# Altium project PCB_F2838_Node.PrjPcb (part 1 of 5)
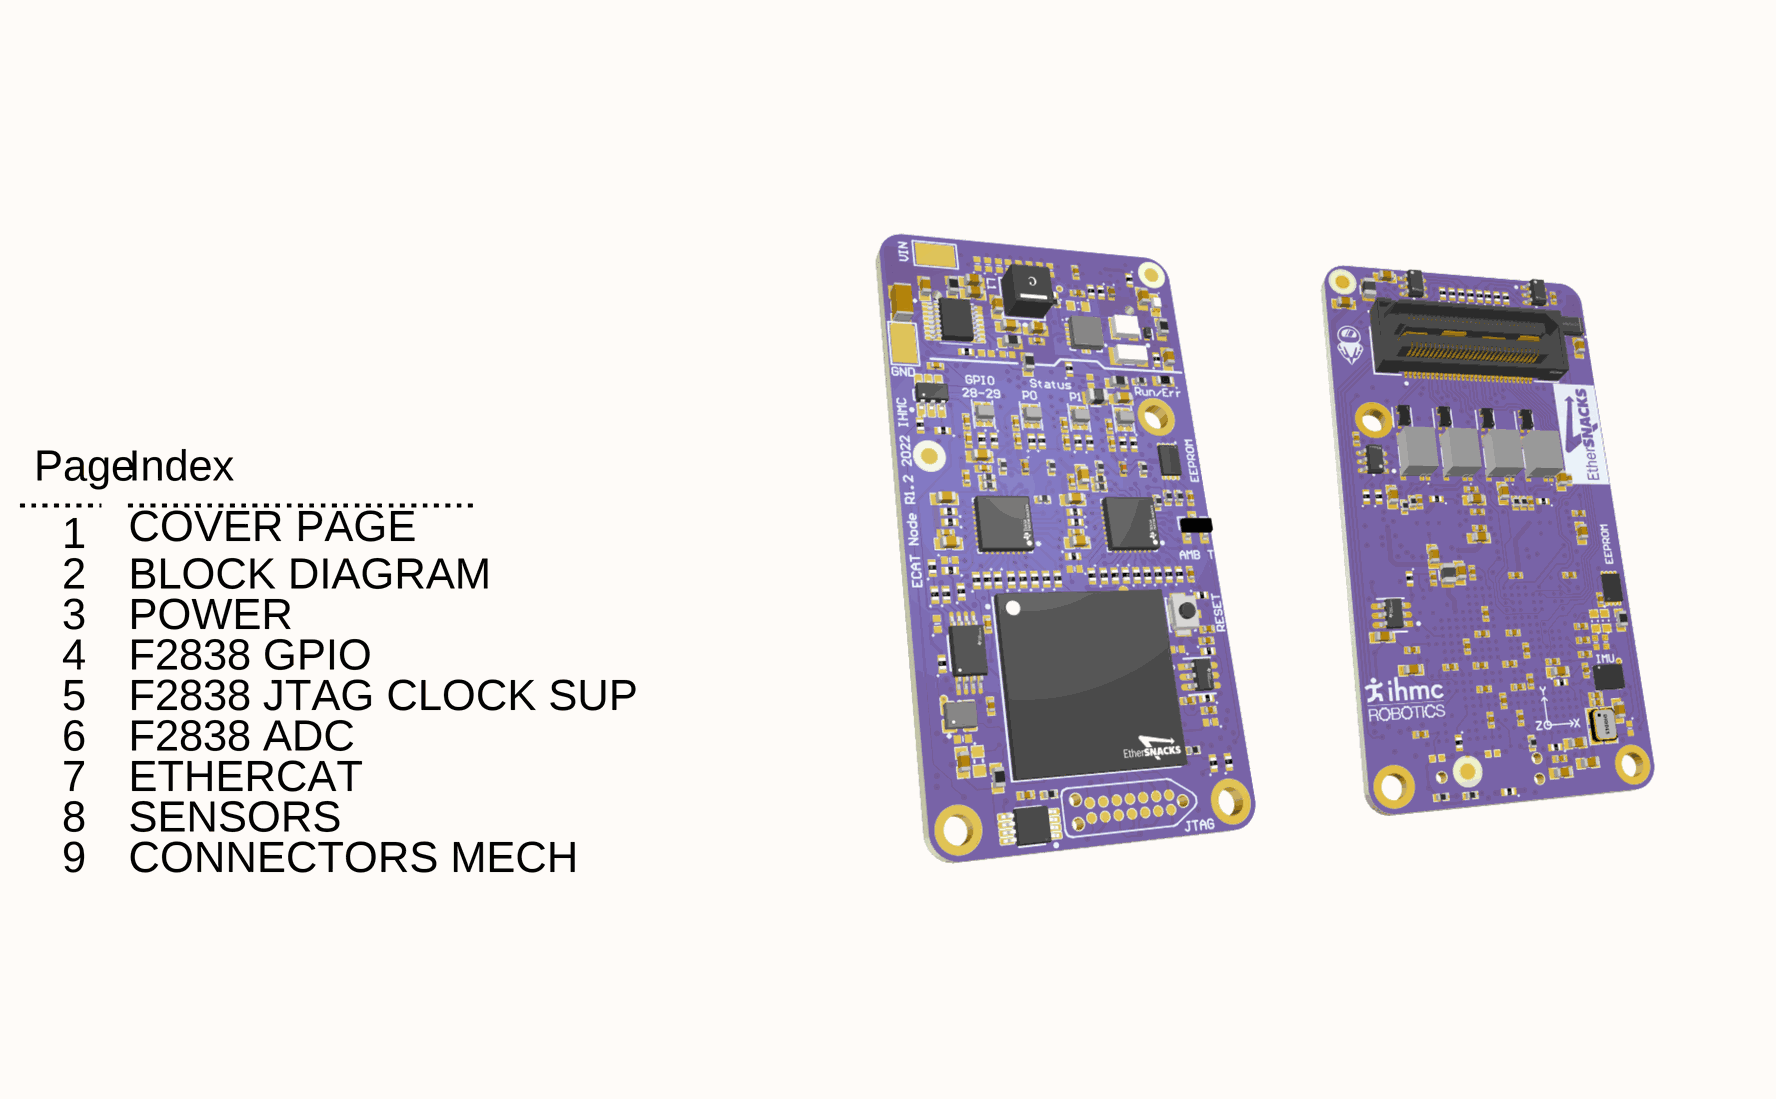
[diagram p0: [0] COVER PAGE.SchDoc]
PCB_Dwg_No: PCB_F2838_Node; Project_Author: A. MASLYCZYK; Project_Date: 24/11/2021; Project_Name: Nadia; Project_Rev_Date: 12/18/2021; Project_Rev_Date_2: 05/09/2022; Project_Revision: 1.1; Project_Revision_2: 1.2; Project_Revision_Description: New stackup 8 layers; Project_Revision_Description_2: Change R77 (ADC REF) to 0R, C54 DNP, onboard EEPROM and revers pol protection added; Project_Title: F28388D_ECAT_Node
9 sheets, 279 parts. Net scope: flat (ports and power ports of the same name join across sheets).
Board file: PCB_F2838_Node.PcbDoc
Sheets:
  [0] COVER PAGE.SchDoc
  [1] BLOCK DIAGRAM.SchDoc
  [2] POWER.SchDoc
  [3] F2838 GPIO.SchDoc
  [4] F2838 JTAG CLOCK SUP.SchDoc
  [5] F2838 ADC.SchDoc
  [6] ETHERCAT.SchDoc
  [7] SENSORS.SchDoc
  [8] CONNECTORS MECH.SchDoc

## Sheet [0] COVER PAGE.SchDoc
size 431 x 279 mm; SheetNumber: 1; SheetTotal: 9

### Notes on the sheet
- Page
- Index
- 1
- COVER PAGE
- 2
- BLOCK DIAGRAM
- 3
- 4
- POWER
- F2838 GPIO
- 5
- 6
- F2838 JTAG CLOCK SUP
- F2838 ADC
- 7
- 8
- ETHERCAT
- SENSORS
- 9
- CONNECTORS MECH
- REVISION
- DESCRIPTION
- DATE
- PROJECT:
- AUTHOR:
- TITLE:
- FILE NAME:
- CUR REV:
- PCB:
- SHEET:
- DATE:
- OF

## Sheet [1] BLOCK DIAGRAM.SchDoc
size 431 x 279 mm; DocumentNumber: 2; SheetNumber: 2; SheetTotal: 9
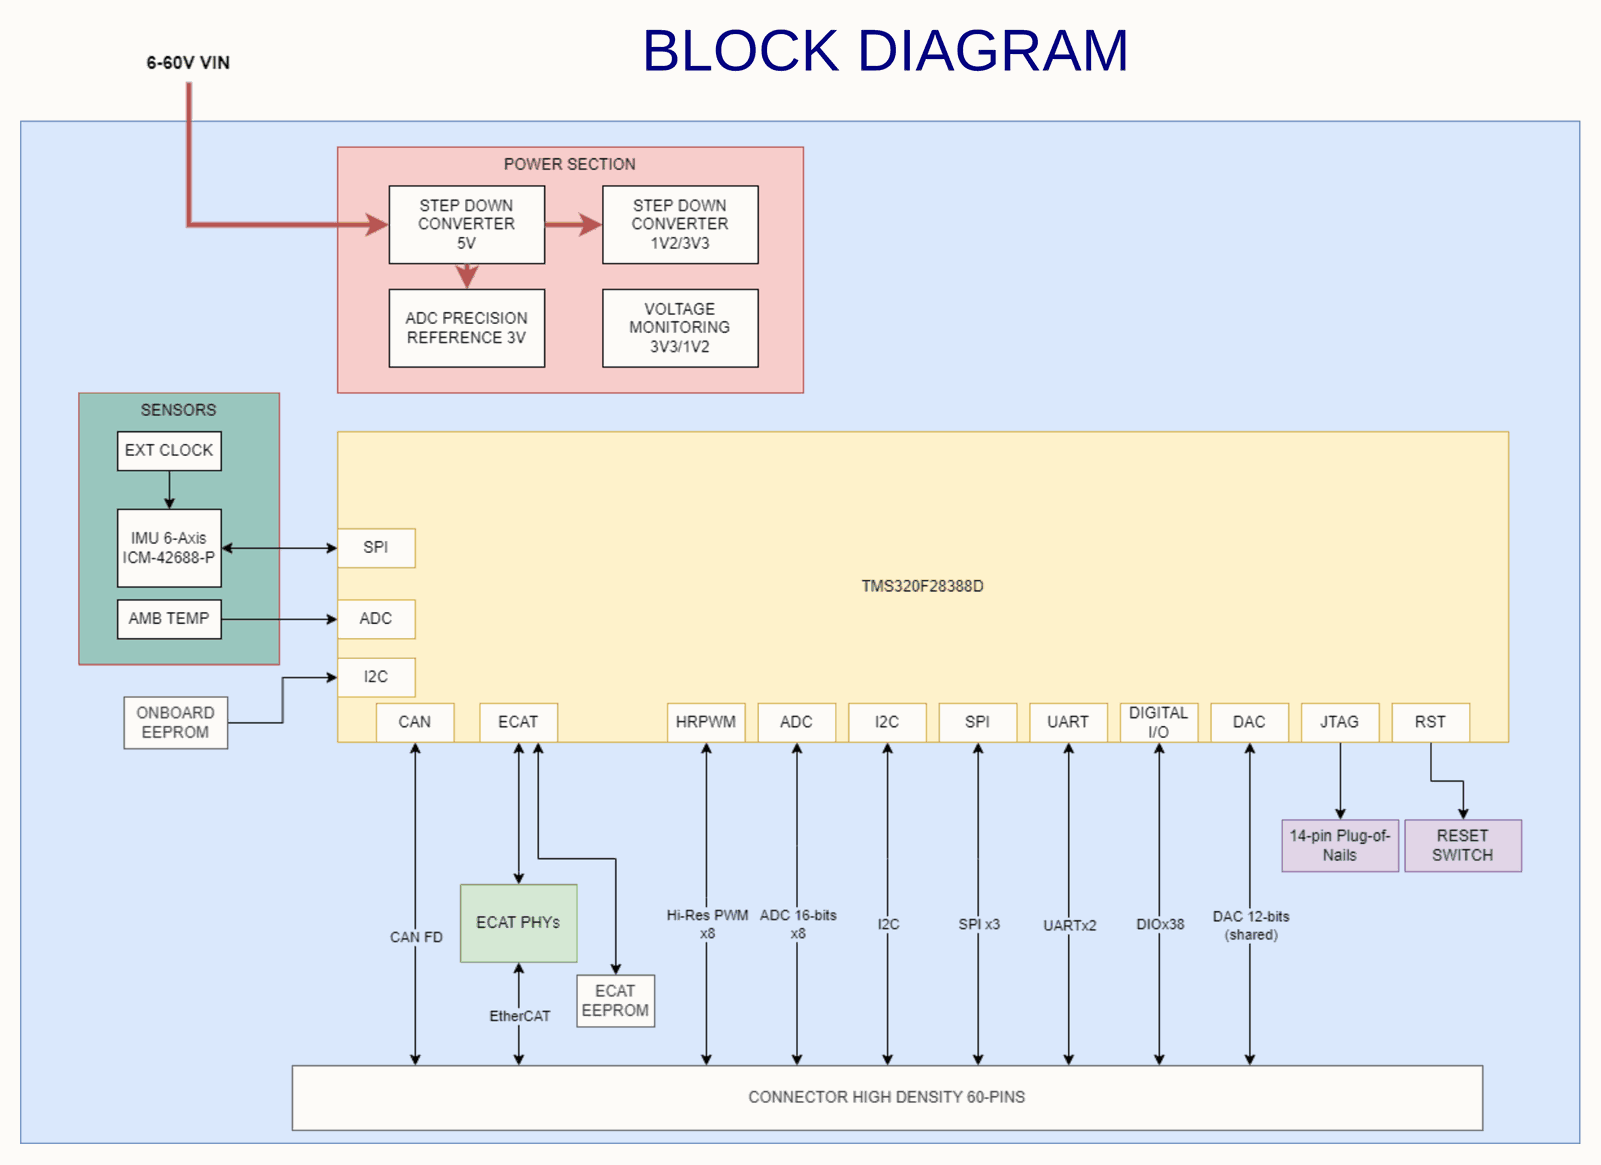
[diagram p1: [1] BLOCK DIAGRAM.SchDoc]

### Notes on the sheet
- BLOCK DIAGRAM
- REVISION
- DESCRIPTION
- DATE
- PROJECT:
- AUTHOR:
- TITLE:
- FILE NAME:
- CUR REV:
- PCB:
- SHEET:
- DATE:
- OF

## Sheet [2] POWER.SchDoc
size 431 x 279 mm; DocumentNumber: 3; SheetNumber: 3; SheetTotal: 9
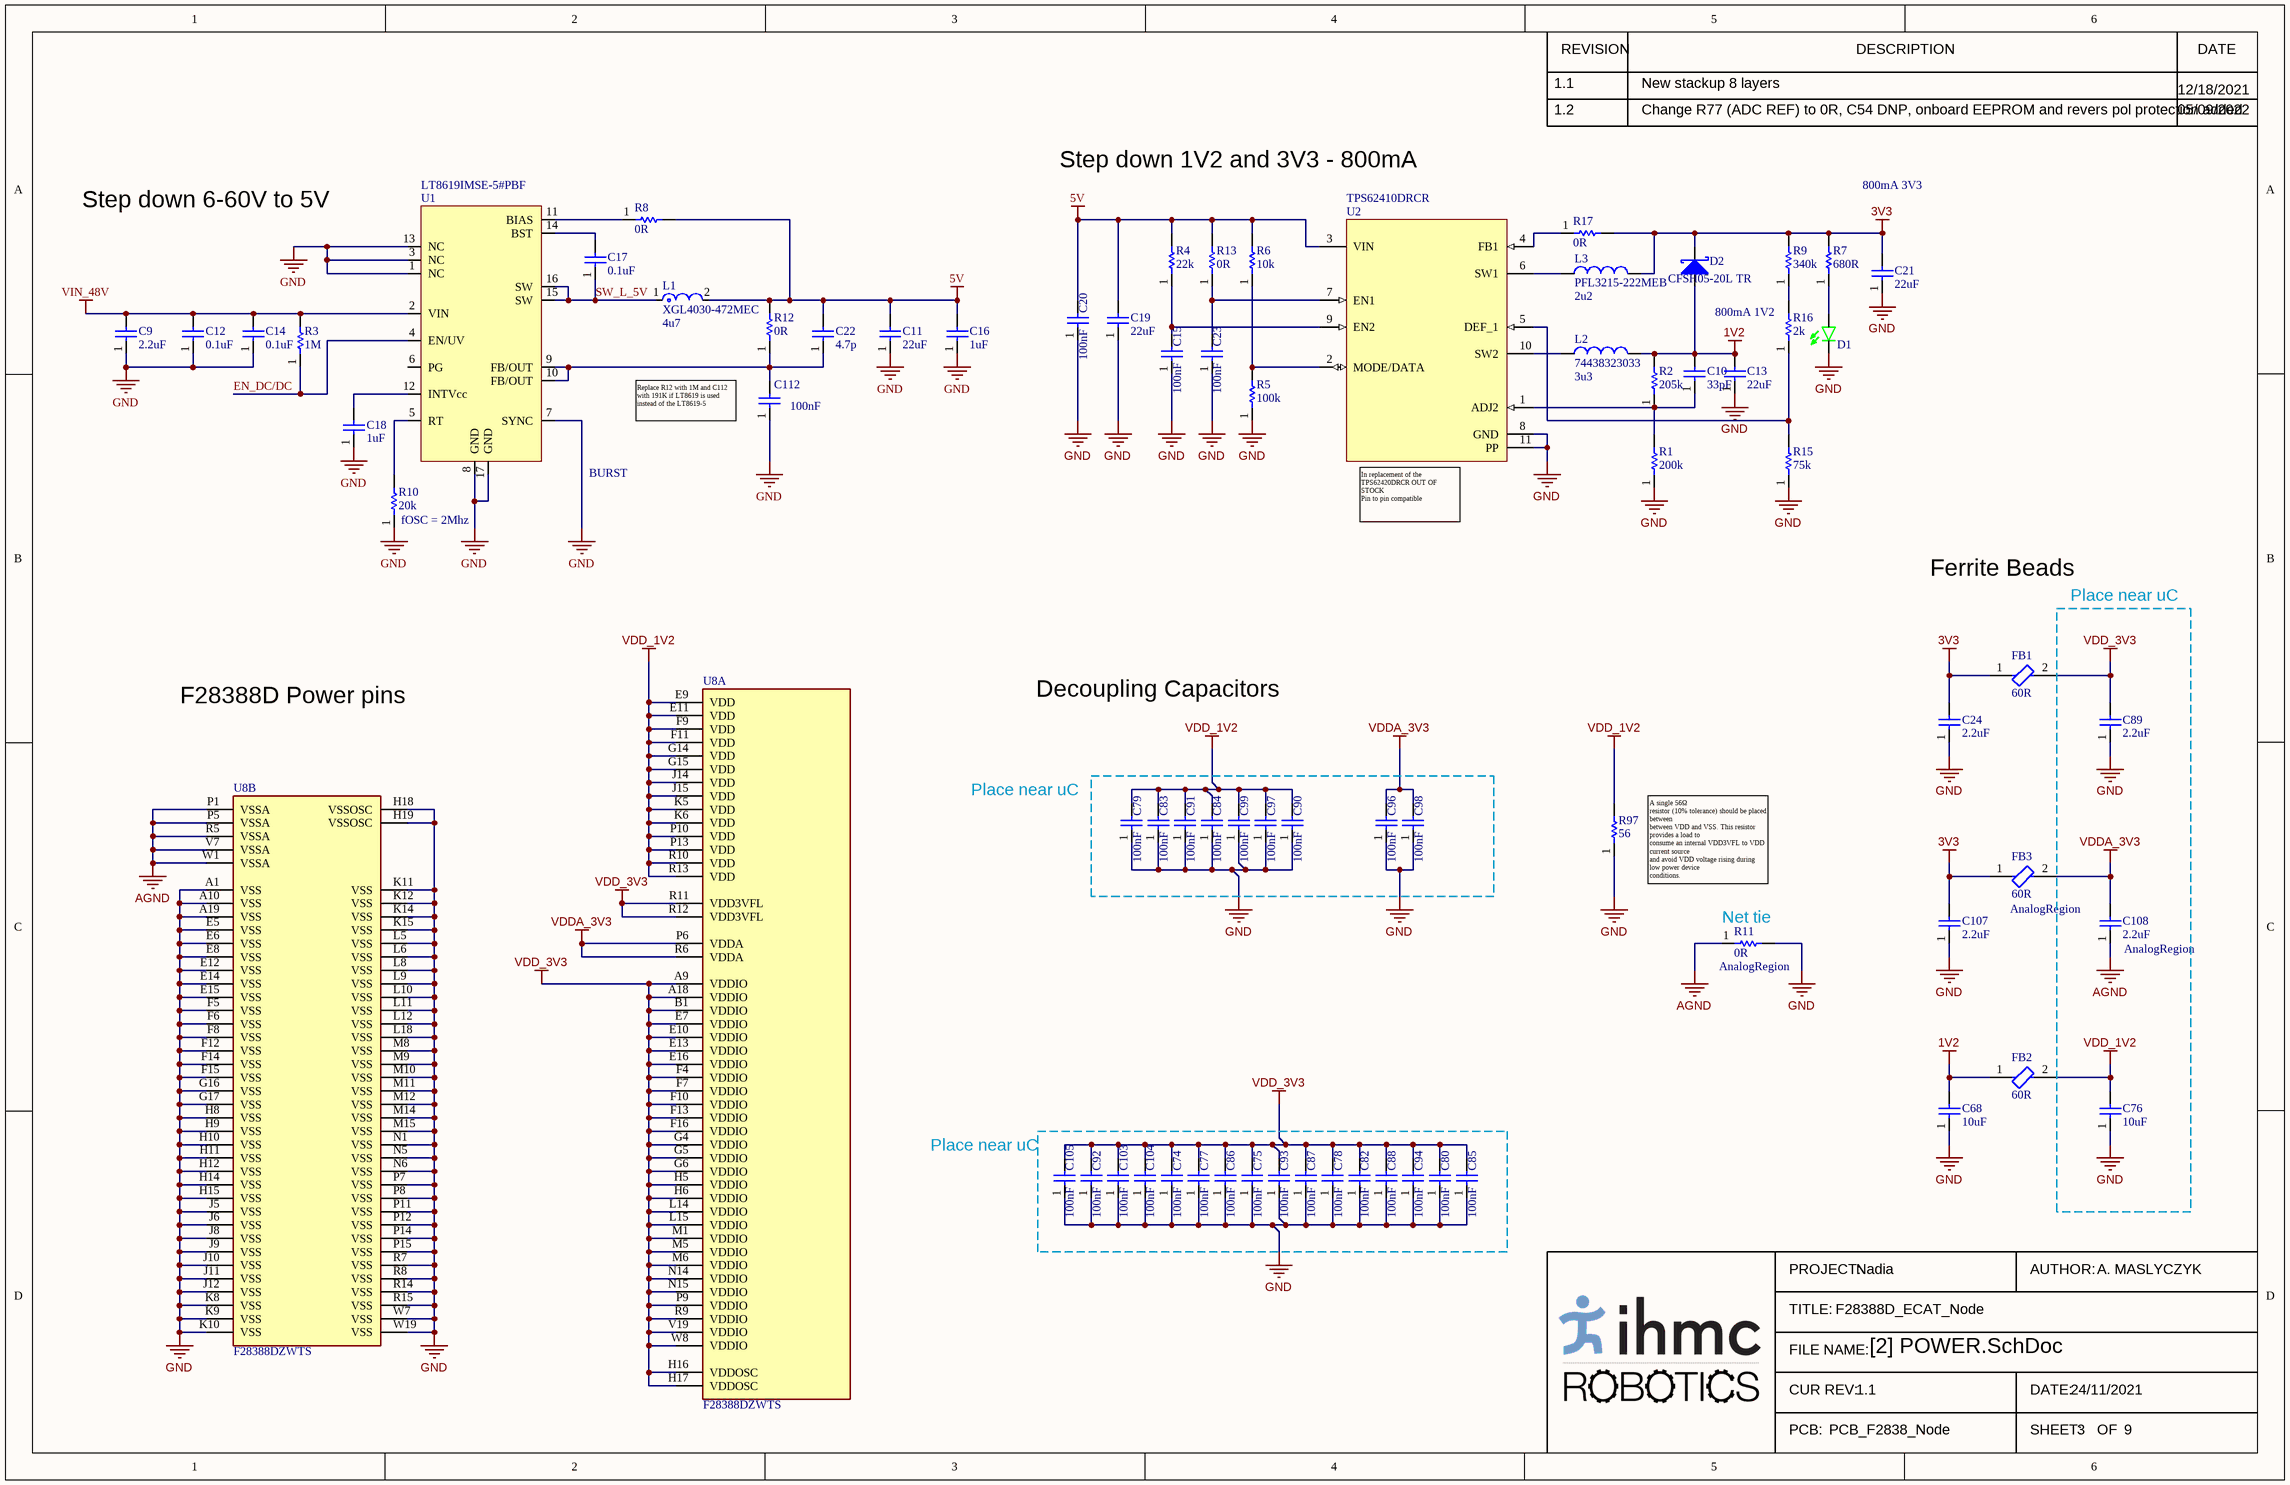
[diagram p2: [2] POWER.SchDoc]

### Parts
C9  value 2.2uF  [CAPC3216X16N(1206)]  (hidden comment: C3216X7S2A225K160AB)
C10  value 33pF  [0402_C]  (hidden comment: 885012005043)
C11  value 22uF  [CAPC1608X09N(0603)]  (hidden comment: C1608X5R1A226M080AC)
C12  value 0.1uF  [CAPC1608X09N(0603)]  (hidden comment: CL10B104KC8NNNC)
C13  value 22uF  [CAPC1608X09N(0603)]  (hidden comment: C1608X5R1A226M080AC)
C14  value 0.1uF  [CAPC1608X09N(0603)]  (hidden comment: CL10B104KC8NNNC)
C15  value 100nF  [CAPC1005X03N(0402)]  (hidden comment: GRM155R71C104JA88D)
C16  value 1uF  [CAPC1608X09N(0603)]  (hidden comment: C0603C105K3PACTU)
C17  value 0.1uF  [CAPC1608X09N(0603)]  (hidden comment: CL10B104KC8NNNC)
C18  value 1uF  [CAPC1608X09N(0603)]  (hidden comment: C0603C105K3PACTU)
C19  value 22uF  [CAPC1608X09N(0603)]  (hidden comment: C1608X5R1A226M080AC)
C20  value 100nF  [CAPC1005X03N(0402)]  (hidden comment: GRM155R71C104JA88D)
C21  value 22uF  [CAPC1608X09N(0603)]  (hidden comment: C1608X5R1A226M080AC)
C22  value 4.7p  [0402_C]  (hidden comment: CGA2B2C0G1H4R7C050BA)
C23  value 100nF  [CAPC1005X03N(0402)]  (hidden comment: GRM155R71C104JA88D)
C24  value 2.2uF  [CAPC1608X09N(0603)]  (hidden comment: GRM188R61A225KE34D)
C68  value 10uF  [CAPC1608X09N(0603)]  (hidden comment: CL10X106MO8NRNC)
C74  value 100nF  [CAPC1005X03N(0402)]  (hidden comment: GRM155R71C104JA88D)
C75  value 100nF  [CAPC1005X03N(0402)]  (hidden comment: GRM155R71C104JA88D)
C76  value 10uF  [CAPC1608X09N(0603)]  (hidden comment: CL10X106MO8NRNC)
C77  value 100nF  [CAPC1005X03N(0402)]  (hidden comment: GRM155R71C104JA88D)
C78  value 100nF  [CAPC1005X03N(0402)]  (hidden comment: GRM155R71C104JA88D)
C79  value 100nF  [CAPC1005X03N(0402)]  (hidden comment: GRM155R71C104JA88D)
C80  value 100nF  [CAPC1005X03N(0402)]  (hidden comment: GRM155R71C104JA88D)
C82  value 100nF  [CAPC1005X03N(0402)]  (hidden comment: GRM155R71C104JA88D)
C83  value 100nF  [CAPC1005X03N(0402)]  (hidden comment: GRM155R71C104JA88D)
C84  value 100nF  [CAPC1005X03N(0402)]  (hidden comment: GRM155R71C104JA88D)
C85  value 100nF  [CAPC1005X03N(0402)]  (hidden comment: GRM155R71C104JA88D)
C86  value 100nF  [CAPC1005X03N(0402)]  (hidden comment: GRM155R71C104JA88D)
C87  value 100nF  [CAPC1005X03N(0402)]  (hidden comment: GRM155R71C104JA88D)
C88  value 100nF  [CAPC1005X03N(0402)]  (hidden comment: GRM155R71C104JA88D)
C89  value 2.2uF  [CAPC1608X09N(0603)]  (hidden comment: GRM188R61A225KE34D)
C90  value 100nF  [CAPC1005X03N(0402)]  (hidden comment: GRM155R71C104JA88D)
C91  value 100nF  [CAPC1005X03N(0402)]  (hidden comment: GRM155R71C104JA88D)
C92  value 100nF  [CAPC1005X03N(0402)]  (hidden comment: GRM155R71C104JA88D)
C93  value 100nF  [CAPC1005X03N(0402)]  (hidden comment: GRM155R71C104JA88D)
C94  value 100nF  [CAPC1005X03N(0402)]  (hidden comment: GRM155R71C104JA88D)
C96  value 100nF  [CAPC1005X03N(0402)]  (hidden comment: GRM155R71C104JA88D)
C97  value 100nF  [CAPC1005X03N(0402)]  (hidden comment: GRM155R71C104JA88D)
C98  value 100nF  [CAPC1005X03N(0402)]  (hidden comment: GRM155R71C104JA88D)
C99  value 100nF  [CAPC1005X03N(0402)]  (hidden comment: GRM155R71C104JA88D)
C103  value 100nF  [CAPC1005X03N(0402)]  (hidden comment: GRM155R71C104JA88D)
C104  value 100nF  [CAPC1005X03N(0402)]  (hidden comment: GRM155R71C104JA88D)
C105  value 100nF  [CAPC1005X03N(0402)]  (hidden comment: GRM155R71C104JA88D)
C107  value 2.2uF  [CAPC1608X09N(0603)]  (hidden comment: GRM188R61A225KE34D)
C108  value 2.2uF  ClassName: AnalogRegion  [CAPC1608X09N(0603)]  (hidden comment: GRM188R61A225KE34D)
C112  value 100nF  [CAPC1005X03N(0402)]  (hidden comment: GRM155R71C104JA88D)
D1  LTST-C193KGKT-5A  [LEDC1608X07N(0603)]  (value not drawn)
D2  CFSH05-20L TR  [SOD-882]
FB1  Impedance: 60R  [FP-BKP2125-IPC_C]  (hidden comment: BKP2125HS600-T)
FB2  Impedance: 60R  [FP-BKP2125-IPC_C]  (hidden comment: BKP2125HS600-T)
FB3  Impedance: 60R  ClassName: AnalogRegion  [FP-BKP2125-IPC_C]  (hidden comment: BKP2125HS600-T)
L1  XGL4030-472MEC  value 4u7  [FP-XGL4030-472MEC-MFG]
L2  74438323033  value 3u3  [SMD 2510]
L3  PFL3215-222MEB  value 2u2  [1206_L]
R1  value 200k  [0402]  (hidden comment: ERJ-2RKF2003X)
R2  value 205k  [0402]  (hidden comment: CRCW0402205KFKED)
R3  value 1M  [RESC1608X09N(0603)]  (hidden comment: RC0603FR-071ML)
R4  value 22k  [0402]  (hidden comment: CRCW040222K0JNED)
R5  value 100k  [RESC1608X09N(0603)]  (hidden comment: ERJ-3EKF1003V)
R6  value 10k  [RESC1005X06N(0402)]  (hidden comment: RC0402FR-0710KL)
R7  value 680R  [RESC1608X09N(0603)]  (hidden comment: RC0603FR-07680RL)
R8  value 0R  [RESC1608X09N(0603)]  (hidden comment: RC0603JR-070RL)
R9  value 340k  [0402]  (hidden comment: CRCW0402340KFKED)
R10  value 20k  [0402]  (hidden comment: ERJ-2RKF2002X)
R11  value 0R  ClassName: AnalogRegion  [0402]  (hidden comment: RCS04020000Z0ED)
R12  value 0R  [RESC1608X09N(0603)]  (hidden comment: RC0603JR-070RL)
R13  value 0R  [0402]  (hidden comment: RCS04020000Z0ED)
R15  value 75k  [0603]  (hidden comment: RT0603DRE0775KL)
R16  value 2k  [RESC1005X06N(0402)]  (hidden comment: RC0402FR-072KL)
R17  value 0R  [RESC1608X09N(0603)]  (hidden comment: RC0603JR-070RL)
R97  value 56  [0402]  (hidden comment: CRCW040256R0JNED)
U1  LT8619IMSE-5#PBF  [SOP50P490X110-17N]
U2  TPS62410DRCR  [DRC0010J_V - 3vias]
U8  F28388DZWTS  [FP-ZWT0337A-IPC_B - ESNACK]  (parts A,B of 8)

### Nets
1V2: C10.2 C13.2 C68.2 D2.2(A) FB2.1 L2.2 R2.2
3V3: C21.2 C24.2 C107.2 D2.1(K) FB1.1 FB3.1 L3.2 R7.2 R9.2 R17.2
5V: C11.2 C16.2 C19.2 C20.2 C22.2 L1.2 R4.2 R6.2 R8.2 R12.2 R13.2 U2.3(VIN)
AGND: C108.1 R11.1 U8.P1(VSSA) U8.P5(VSSA) U8.R5(VSSA) U8.V7(VSSA) U8.W1(VSSA)
GND: C9.1 C11.1 C12.1 C13.1 C14.1 C15.1 C16.1 C18.1 C19.1 C20.1 C21.1 C23.1 C24.1 C68.1 C74.1 C75.1 C76.1 C77.1 C78.1 C79.1 C80.1 C82.1 C83.1 C84.1 C85.1 C86.1 C87.1 C88.1 C89.1 C90.1 C91.1 C92.1 C93.1 C94.1 C96.1 C97.1 C98.1 C99.1 C103.1 C104.1 C105.1 C107.1 C112.1 D1.C R1.1 R5.1 R10.1 R11.2 R15.1 R97.1 U1.1(NC) U1.3(NC) U1.7(SYNC) U1.8(GND) U1.13(NC) U1.17(GND) U2.8(GND) U2.11(PP) U8.A1(VSS) U8.A10(VSS) U8.A19(VSS) U8.E5(VSS) U8.E6(VSS) U8.E8(VSS) U8.E12(VSS) U8.E14(VSS) U8.E15(VSS) U8.F5(VSS) U8.F6(VSS) U8.F8(VSS) U8.F12(VSS) U8.F14(VSS) U8.F15(VSS) U8.G16(VSS) U8.G17(VSS) U8.H8(VSS) U8.H9(VSS) U8.H10(VSS) U8.H11(VSS) U8.H12(VSS) U8.H14(VSS) U8.H15(VSS) U8.H18(VSSOSC) U8.H19(VSSOSC) U8.J5(VSS) U8.J6(VSS) U8.J8(VSS) U8.J9(VSS) U8.J10(VSS) U8.J11(VSS) U8.J12(VSS) U8.K8(VSS) U8.K9(VSS) U8.K10(VSS) U8.K11(VSS) U8.K12(VSS) U8.K14(VSS) U8.K15(VSS) U8.L5(VSS) U8.L6(VSS) U8.L8(VSS) U8.L9(VSS) U8.L10(VSS) U8.L11(VSS) U8.L12(VSS) U8.L18(VSS) U8.M8(VSS) U8.M9(VSS) U8.M10(VSS) U8.M11(VSS) U8.M12(VSS) U8.M14(VSS) U8.M15(VSS) U8.N1(VSS) U8.N5(VSS) U8.N6(VSS) U8.P7(VSS) U8.P8(VSS) U8.P11(VSS) U8.P12(VSS) U8.P14(VSS) U8.P15(VSS) U8.R7(VSS) U8.R8(VSS) U8.R14(VSS) U8.R15(VSS) U8.W7(VSS) U8.W19(VSS)
VDD_1V2: C76.2 C79.2 C83.2 C84.2 C90.2 C91.2 C97.2 C99.2 FB2.2 R97.2 U8.E9(VDD) U8.E11(VDD) U8.F9(VDD) U8.F11(VDD) U8.G14(VDD) U8.G15(VDD) U8.J14(VDD) U8.J15(VDD) U8.K5(VDD) U8.K6(VDD) U8.P10(VDD) U8.P13(VDD) U8.R10(VDD) U8.R13(VDD)
VDD_3V3: C74.2 C75.2 C77.2 C78.2 C80.2 C82.2 C85.2 C86.2 C87.2 C88.2 C89.2 C92.2 C93.2 C94.2 C103.2 C104.2 C105.2 FB1.2 U8.A9(VDDIO) U8.A18(VDDIO) U8.B1(VDDIO) U8.E7(VDDIO) U8.E10(VDDIO) U8.E13(VDDIO) U8.E16(VDDIO) U8.F4(VDDIO) U8.F7(VDDIO) U8.F10(VDDIO) U8.F13(VDDIO) U8.F16(VDDIO) U8.G4(VDDIO) U8.G5(VDDIO) U8.G6(VDDIO) U8.H5(VDDIO) U8.H6(VDDIO) U8.H16(VDDOSC) U8.H17(VDDOSC) U8.L14(VDDIO) U8.L15(VDDIO) U8.M1(VDDIO) U8.M5(VDDIO) U8.M6(VDDIO) U8.N14(VDDIO) U8.N15(VDDIO) U8.P9(VDDIO) U8.R9(VDDIO) U8.R11(VDD3VFL) U8.R12(VDD3VFL) U8.V19(VDDIO) U8.W8(VDDIO)
VDDA_3V3: C96.2 C98.2 C108.2 FB3.2 U8.P6(VDDA) U8.R6(VDDA)
VIN_48V: C9.2 C12.2 C14.2 R3.2 U1.2(VIN)
EN_DC/DC: R3.1 U1.4(EN/UV)
SW_L_5V: C17.1 L1.1 U1.15(SW) U1.16(SW)
NetC10_1: C10.1 R1.2 R2.1 U2.1(ADJ2)
NetC15_2: C15.2 R4.1 U2.9(EN2)
NetC17_2: C17.2 U1.14(BST)
NetC18_2: C18.2 U1.12(INTVcc)
NetC22_1: C22.1 C112.2 R12.1 U1.9(FB/OUT) U1.10(FB/OUT)
NetC23_2: C23.2 R13.1 U2.7(EN1)
NetD1_A: D1.A R7.1
NetL2_1: L2.1 U2.10(SW2)
NetL3_1: L3.1 U2.6(SW1)
NetR5_2: R5.2 R6.1 U2.2(MODE/DATA)
NetR8_1: R8.1 U1.11(BIAS)
NetR9_1: R9.1 R16.2
NetR10_2: R10.2 U1.5(RT)
NetR15_2: R15.2 R16.1 U2.5(DEF_1)
NetR17_1: R17.1 U2.4(FB1)

Not connected (* = marked no-connect by the designer): U1 6(PG)

### Notes on the sheet
- Step down 1V2 and 3V3 - 800mA
- Step down 6-60V to 5V
- 800mA 3V3
- (near R16) 800mA 1V2
- Replace R12 with 1M and C112 with 191K if LT8619 is used instead of the LT8619-5
- (near U1) BURST
- (near R10) fOSC = 2Mhz
- (near U2) In replacement of the TPS62420DRCR OUT OF STOCK
  Pin to pin compatible
- Ferrite Beads
- Place near uC
- F28388D Power pins
- Decoupling Capacitors
- (near R97) A single 56Ω
  resistor (10% tolerance) should be placed between
  between VDD and VSS. This resistor provides a load to
  consume an internal VDD3VFL to VDD current source
  and avoid VDD voltage rising during low power device
  conditions.
- (near R11) Net tie
- (near C105) Place near uC
- REVISION
- DESCRIPTION
- DATE
- PROJECT:
- AUTHOR:
- TITLE:
- FILE NAME:
- CUR REV:
- PCB:
- SHEET:
- DATE:
- OF

### Library data of the parts
C9 = 2.2uF_100V_1206_Cap: CAP CER 2.2UF 100V X7S 1206; Tolerance: 10%; MPN: C3216X7S2A225K160AB; Voltage Rating: 100V; Temp Coefficient: X7S; Package/Case: 1206; Mounting Type: Surface Mount; Supplier 1: Digi-Key; Supplier Part Number 1: 445-5207-1-ND
C10 = 33pF_25V_5%_C0G_0402_885012005043_CAP: Cap, Mlcc, Np0, 33Pf, 25V, 0402 Rohs Compliant: Yes; Manufacturer: Wurth Electronics; Tolerance: 5%; Supplier 1: Digi-Key; Manufacturer Part Number: 885012005043; RoHS: Yes; Category: Ceramic Capacitors; Stock 1: 72; Pricing 1: 1=0.10000, 10=0.01500, 100=0.01400, 500=0.01200 (USD); Mount: Surface Mount; Case/Package: 0402; Case Code (Metric): 1005; Case Code (Imperial): 0402; Min Operating Temperature: -55°C; Max Operating Temperature: 125°C; Packaging: Tape and Reel; Capacitance: 33pF; Voltage Rating: 25V; Length: 0.039inch; Width: 0.02inch; Thickness: 0.022inch; RoHS Compliant: Yes; ComponentLink1URL: https://katalog.we-online.de/pbs/datasheet/885012005043.pdf?src-supplier=Digi-Key; ComponentLink1Description: https://katalog.we-online.de/pbs/datasheet/885012005043.pdf?src-supplier=Digi-Key; Supplier Part Number 1: 732-7458-1-ND
C11 C13 C19 C21 = 22uF_10V_0603_CAP: CAP CER 22UF 10V X5R 0603; Tolerance: 20%; MPN: C1608X5R1A226M080AC; Voltage: 10V; Temp Cofficient: X5R; Package: 0603; Supplier 1: Digikey; Supplier Part Number 1: 445-9077-6-ND
C12 C14 C17 = 0.1uF_100V_0603_CAP: CAP CER 0.1UF 100V X7R 0603; Tolerance: 10%; MPN: CL10B104KC8NNNC; Volage Rating: 100V; Temp Coefficent: X7R; Mounting Type: Surface Mount; Case/Package: 0603; Supplier 1: Digi-Key; Supplier Part Number 1: 1276-6807-1-ND
C15 C20 C23 C74 C75 C77-C80 C82-C88 C90-C94 C96-C99 C103-C105 C112 = 100nF_16V_0402_CAP: CAP CER 0.1UF 16V X7R 0402; Tolerance: 5%; MPN: GRM155R71C104JA88D; Voltage Rating: 16V; Temp Coeff: X7R; Size/Package: 0402
C16 C18 = 1uF_25VDC_0603_Cap: MLCC - SMD/SMT 25volts 1uF X5R 10%; Voltage: 25VDC; Drawn By: TC; MPN: C0603C105K3PACTU; Tolerance: 10%; Supplier 1: Mouser; Supplier Part Number 1: 80-C0603C105K3PAC
C22 = 4p7_0402_50V_C0G_  CGA2B2C0G1H4R7C050BA: Multilayer Ceramic Capacitor, CGA Series, 4.7 pF, 0.25pF, C0G / NP0, 50 V, 0402 [1005 Metric] ;RoHS Compliant: Yes; Manufacturer: TDK; Capacitance: 4.7pF; Voltage Rating: 50V; Supplier 1: Digi-Key; Manufacturer Part Number: CGA2B2C0G1H4R7C050BA; RoHS: Yes; Category: Ceramic Capacitors; Stock 1: 26180; Pricing 1: 1=0.10000, 10=0.06000, 50=0.03300, 100=0.02700, 500=0.01924, 1000=0.01512, 2500=0.01375, 5000=0.01265 (USD); Mount: Surface Mount; Case/Package: 0402; Case Code (Metric): 1005; Case Code (Imperial): 0402; Weight: 2.3E-05oz; Min Operating Temperature: -55°C; Max Operating Temperature: 125°C; Packaging: Cut Tape; Voltage Rating (DC): 50V; Dielectric: C0G; Termination: Standard; Series: CGA; Package Quantity: 10000; Resistor Type: Ceramic; Length: 1mm; Width: 0.5mm; Height: 0.5mm; Thickness: 0.022inch; Depth: 0.5mm; Ratings: AEC-Q200; RoHS Compliant: Yes; REACH SVHC: No SVHC; ComponentLink1URL: https://datasheet.ciiva.com/24217/cga2b2c0g1h4r7c050ba-265785-24217343.pdf?src-supplier=Mouser; ComponentLink1Description: https://datasheet.ciiva.com/24217/cga2b2c0g1h4r7c050ba-265785-24217343.pdf?src-supplier=Mouser; Supplier Part Number 1: 445-5577-1-ND
C24 C89 C107 C108 = 2.2uF_10V_0603_CAP: CAP CER 2.2UF 10V X5R 0603; Tolerance: 10%; MPN: GRM188R61A225KE34D; Voltage Rating: 10V; Temp Cofficient: X5R; Size: 0603; Supplier 1: Digikey; Supplier Part Number 1: 490-1545-1-ND
C68 C76 = 10uF_16V_0603_CAP: CAP CER 10UF 16V X6S 0603; Tolerance: 20%; MPN: CL10X106MO8NRNC; Voltage: 16V; Temp Coeff: X6S; Package/Case: 0603; Mounting Type: Surface Mount; Supplier 1: Digi-Key; Supplier Part Number 1: 1276-6769-1-ND
D1 = GREEN_LED_0603: LED GREEN CLEAR CHIP SMD; If: 5mA; Vf: 2V; MPN: LTST-C193KGKT-5A; Drawn By: TC; Supplier 1: Digi-Key; Color: Green; Supplier Part Number 1: 160-1828-1-ND
D2 = CFSH05-20L TR_SCHOTTKY_20V_500mA_SOD882_DIODE: Silicon SCHOTTKY Diode Low Forward Voltage 20V 3A 2-Pin SOD-882L Surface Mount T/R; Manufacturer: Central Semiconductor; Average Rectified Current: 500mA; Element Configuration: Single; Forward Voltage: 450mV; Max Reverse Current: 8uA; Max Power Dissipation: 100mW; Supplier 1: Digi-Key; Manufacturer Part Number: CFSH05-20L TR; RoHS: No; Category: Rectifier Diodes; Stock 1: 73544; Pricing 1: 1=0.50000, 10=0.40700, 100=0.27700, 500=0.20776, 1000=0.15583, 2000=0.14284 (USD); Mount: Surface Mount; Min Operating Temperature: -65°C; Max Operating Temperature: 150°C; Packaging: Tape and Reel; Reverse Voltage (DC): 20V; Termination: SMD/SMT; Forward Current: 500mA; Max Repetitive Reverse Voltage (Vrrm): 20V; Max Forward Surge Current (Ifsm): 3A; Package Quantity: 8000; Max Reverse Voltage (DC): 20V; Length: 1.05mm; Width: 0.65mm; Lead Free: Lead Free; ComponentLink1URL: http://www.mouser.com/ds/2/68/cfsh05-20l-370494.pdf?src-supplier=Mouser; ComponentLink1Description: http://www.mouser.com/ds/2/68/cfsh05-20l-370494.pdf?src-supplier=Mouser; ComponentLink2URL: https://www.centralsemi.com/get_document.php?cmp=1&mergetype=pd&mergepath=pd&pdf_id=CFSH05-20L.PDF&src-supplier=Digi-Key; ComponentLink2Description: https://www.centralsemi.com/get_document.php?cmp=1&mergetype=pd&mergepath=pd&pdf_id=CFSH05-20L.PDF&src-supplier=Digi-Key; ComponentLink3URL: https://my.centralsemi.com/get_document.php?cmp=1&mergetype=pd&mergepath=pd&pdf_id=CFSH05-20L.PDF&src-supplier=Digi-Key; ComponentLink3Description: https://my.centralsemi.com/get_document.php?cmp=1&mergetype=pd&mergepath=pd&pdf_id=CFSH05-20L.PDF&src-supplier=Digi-Key; ComponentLink4URL: https://my.centralsemi.com/get_document.php?cmp=1&amp;mergetype=pd&amp;mergepath=pd&amp;pdf_id=CFSH05-20L.PDF&src-supplier=Digi-Key; ComponentLink4Description: https://my.centralsemi.com/get_document.php?cmp=1&amp;mergetype=pd&amp;mergepath=pd&amp;pdf_id=CFSH05-20L.PDF&src-supplier=Digi-Key; Supplier Part Number 1: 1514-CFSH05-20LTRPBFREECT-ND
FB1-FB3 = 60R_100Mhz_0805_3A: TAIYO YUDEN - BKP2125HS600-T - Ferrite Bead, 0805 [2012 Metric], 60 ohm, 3 A, BKP Series, 0.025 ohm, ± 25%; Max DC Current: 3A; Number of Lines: 1; DC Resistance (DCR): 25mR; Test Frequency: 100MHz; Shielding: Unshielded; Packaging: Tape and Reel; Case Code (Imperial): 0805; Series: BK; Package Quantity: 1; Tolerance: 25%; Lead Free: Lead Free; Number of Pins: 2; Max Current Rating: 3A; Length: 2.3mm; Case/Package: 0805; Max Operating Temperature: 85°C; Min Operating Temperature: -55°C; Core Material: Ferrite; Case Code (Metric): 2125; Depth: 1.45mm; Resistance: 25mR; Halogen Free: Halogen Free; Termination: SMD/SMT; Width: 0.049inch; RoHS Compliant: Yes; Mount: Surface Mount; Height: 1.05mm; Supplier 1: Digi-Key; Manufacturer: Taiyo Yuden; Manufacturer Part Number: BKP2125HS600-T; RoHS: Yes; Category: Inductors; Stock 1: 308405; Pricing 1: 1=0,12000, 10=0,09400, 25=0,08480, 50=0,06200, 100=0,05360, 250=0,04232, 500=0,03574, 1000=0,03010 (USD); REACH SVHC: Unknown; ComponentLink1URL: https://datasheet.ciiva.com/6213/bkp2125hs600-t-ss-6213090.pdf?src-supplier=Digi-Key; ComponentLink1Description: https://datasheet.ciiva.com/6213/bkp2125hs600-t-ss-6213090.pdf?src-supplier=Digi-Key; ComponentLink2URL: https://datasheet.ciiva.com/30063/884bkp2125hs600-t-30063956.pdf?src-supplier=Onlinecomponents.com; ComponentLink2Description: https://datasheet.ciiva.com/30063/884bkp2125hs600-t-30063956.pdf?src-supplier=Onlinecomponents.com; ComponentLink3URL: https://datasheet.ciiva.com/6213/mlci08-e-6213094.pdf?src-supplier=Digi-Key; ComponentLink3Description: https://datasheet.ciiva.com/6213/mlci08-e-6213094.pdf?src-supplier=Digi-Key; ComponentLink4URL: https://datasheet.ciiva.com/6213/mlci08-e-6213097.pdf?src-supplier=Digi-Key; ComponentLink4Description: https://datasheet.ciiva.com/6213/mlci08-e-6213097.pdf?src-supplier=Digi-Key; Supplier Part Number 1: 587-1932-1-ND
L1 = XGL4030-472MEC_4u7_2A1_IND: Inductor Power Shielded Wirewound 4.7uH 20% 1MHz Composite 6.6A 31.5mOhm DCR Automotive T/R; DCRMax: 31.5; Isat10%: 2.1; MPN: XGL4030-472
L2 = 3.3uH_1.25A_2520_IND: Inductor Power Shielded Wirewound 3.3uH 20% 100KHz Powdered Iron 1.25A 264mOhm DCR 1008 T/R; Manufacturer: Wurth Electronics; Core Material: Metal,Composite,Ferrite; Self Resonant Frequency: 50MHz; Saturation Current: 2.1A; DC Resistance (DCR): 264mR; Series Resistance: 220mR; Supplier 1: Digi-Key; Manufacturer Part Number: 74438323033; RoHS: Yes; Category: Fixed Inductors; Stock 1: 3322; Pricing 1: 1=1.16000, 10=1.14800, 50=1.07100, 100=0.99500, 500=0.91800, 1000=0.84100 (USD); Mount: Surface Mount; Case/Package: SMD/SMT; Case Code (Metric): 2520; Case Code (Imperial): 1008; Weight: 0.001129oz; Min Operating Temperature: -40°C; Max Operating Temperature: 125°C; Tolerance: 20%; Shielding: Shielded; Package Quantity: 3000; Current Rating: 1.25A; Inductance Tolerance: 20%; Inductance: 3.3uH; Packaging: Tape and Reel; Test Frequency: 100kHz; Max DC Current: 1.25A; Termination: SMD/SMT; RMS Current (Irms): 1.25A; Length: 2.5mm; Width: 0.079inch; Height: 1mm; Height - Seated (Max): 0.039inch; Depth: 2mm; REACH SVHC: Unknown; RoHS Compliant: Yes; ComponentLink1URL: https://datasheet.ciiva.com/24214/74438323033-268049-24214225.pdf?src-supplier=Mouser; ComponentLink1Description: https://datasheet.ciiva.com/24214/74438323033-268049-24214225.pdf?src-supplier=Mouser; ComponentLink2URL: https://datasheet.ciiva.com/29697/74438323033-29697185.pdf?src-supplier=Digi-Key; ComponentLink2Description: https://datasheet.ciiva.com/29697/74438323033-29697185.pdf?src-supplier=Digi-Key; ComponentLink3URL: https://datasheet.ciiva.com/30489/0900766b812968df-30489181.pdf?src-supplier=RSComponents; ComponentLink3Description: https://datasheet.ciiva.com/30489/0900766b812968df-30489181.pdf?src-supplier=RSComponents; ComponentLink4URL: https://datasheet.ciiva.com/22748/1754785-22748252.pdf?src-supplier=Element14; ComponentLink4Description: https://datasheet.ciiva.com/22748/1754785-22748252.pdf?src-supplier=Element14; Supplier Part Number 1: 732-4847-1-ND
L3 = 2.2uH_1.4A_1206_PFL3215-222MEB_IND: Power inductor, shielded, 20% tol, SMT, RoHS, halogen-f; Manufacturer: Coilcraft; Core Material: Composite; Self Resonant Frequency: 250MHz; Inductance: 2.2uH; Max DC Current: 1.4A; DC Resistance (DCR): 130mR; Test Frequency: 7.9MHz; Saturation Current: 950mA; Supplier 1: Mouser; Manufacturer Part Number: PFL3215-222MEB; RoHS: Yes; Category: Fixed Inductors; Case/Package: SMD/SMT; Min Operating Temperature: -40°C; Max Operating Temperature: 85°C; Packaging: Cut Tape; Tolerance: 20%; Shielding: Shielded; Termination: SMD/SMT; Series: PFL3215; Inductance Tolerance: 20%; RMS Current (Irms): 1.4A; Length: 3.2mm; Width: 2.286mm; Height: 1.5mm; Lead Free: Contains Lead; RoHS Compliant: Yes; REACH SVHC: No SVHC; ComponentLink1URL: https://datasheet.ciiva.com/22679/1681969-22679176.pdf?src-supplier=Element14; ComponentLink1Description: https://datasheet.ciiva.com/22679/1681969-22679176.pdf?src-supplier=Element14; ComponentLink2URL: https://datasheet.ciiva.com/22708/1681969-22708921.pdf?src-supplier=Element14; ComponentLink2Description: https://datasheet.ciiva.com/22708/1681969-22708921.pdf?src-supplier=Element14; Supplier Part Number 1: 994-PFL3215-222MEB
R1 = 200k_0402_1%_ERJ-2RKF2003X_RES: Res Thick Film 0402 200K Ohm 1% 1/10W ±100ppm/|C SMD Punched Carrier T/R; Manufacturer: Panasonic; Resistance: 200kR; Power Rating: 100mW; Voltage Rating: 50V; Temperature Coefficient: 100ppm/°C; Supplier 1: Digi-Key; Manufacturer Part Number: ERJ-2RKF2003X; RoHS: Yes; Category: Chip SMD Resistors; Stock 1: 202120; Pricing 1: 1=0.10000, 10=0.02800, 100=0.01150, 1000=0.00518, 2500=0.00450, 5000=0.00371 (USD); Mount: Surface Mount; Case/Package: 402; Number of Pins: 2; Case Code (Imperial): 0402; Case Code (Metric): 1005; Contact Plating: Tin; Package Shape: Rectangular; Min Operating Temperature: -55°C; Max Operating Temperature: 155°C; Tolerance: 1%; Packaging: Tape and Reel; Package Quantity: 1; Termination: SMD/SMT; Resistor Type: Thick Film; Number of Terminations: 2; Max Power Dissipation: 100mW; Voltage Rating (DC): 50V; Features: Automotive AEC-Q200; Technology: THICK FILM; Length: 1mm; Width: 0.5mm; Height: 0.35mm; Depth: 0.5mm; Radiation Hardening: No; REACH SVHC: No SVHC; Military Standard: Not; Lead Free: Lead Free; RoHS Compliant: Yes; ComponentLink1URL: https://datasheet.ciiva.com/11821/0900766b80f80784-11821224.pdf?src-supplier=RSComponents; ComponentLink1Description: https://datasheet.ciiva.com/11821/0900766b80f80784-11821224.pdf?src-supplier=RSComponents; ComponentLink2URL: https://datasheet.ciiva.com/46387/426256-46387157.pdf?src-supplier=Element14; ComponentLink2Description: https://datasheet.ciiva.com/46387/426256-46387157.pdf?src-supplier=Element14; ComponentLink3URL: https://datasheet.ciiva.com/5868/426256-5868117.pdf?src-supplier=Farnell; ComponentLink3Description: https://datasheet.ciiva.com/5868/426256-5868117.pdf?src-supplier=Farnell; ComponentLink4URL: https://datasheet.ciiva.com/46374/426256-46374221.pdf?src-supplier=Element14; ComponentLink4Description: https://datasheet.ciiva.com/46374/426256-46374221.pdf?src-supplier=Element14; ComponentLink5URL: https://datasheet.ciiva.com/28675/1678782-28675803.pdf?src-supplier=Element14; ComponentLink5Description: https://datasheet.ciiva.com/28675/1678782-28675803.pdf?src-supplier=Element14; ComponentLink6URL: https://datasheet.ciiva.com/24073/aoa0000ce2-24073141.pdf?src-supplier=Mouser; ComponentLink6Description: https://datasheet.ciiva.com/24073/aoa0000ce2-24073141.pdf?src-supplier=Mouser; ComponentLink7URL: https://datasheet.ciiva.com/16775/70260748-16775805.pdf?src-supplier=Allied+Electronics; ComponentLink7Description: https://datasheet.ciiva.com/16775/70260748-16775805.pdf?src-supplier=Allied+Electronics; ComponentLink8URL: https://datasheet.ciiva.com/16759/70260748-16759806.pdf?src-supplier=Allied+Electronics; ComponentLink8Description: https://datasheet.ciiva.com/16759/70260748-16759806.pdf?src-supplier=Allied+Electronics; Supplier Part Number 1: P200KLCT-ND
R2 = 205k_0402_1%_CRCW0402205KFKED_RES: Res Thick Film 0402 205K Ohm 1% 1/16W ±100ppm/°C Molded SMD SMD Paper T/R; Manufacturer: Vishay; Resistance: 205kR; Power Rating: 63mW; Voltage Rating: 50V; Supplier 1: Digi-Key; Manufacturer Part Number: CRCW0402205KFKED; RoHS: Yes; Category: Chip SMD Resistors; Stock 1: 4470; Pricing 1: 1=0.10000, 10=0.03800, 100=0.01530, 1000=0.00686, 2500=0.00595, 5000=0.00492 (USD); Case/Package: 0402; Number of Pins: 2; Weight: 2.3E-05oz; Case Code (Imperial): 0402; Case Code (Metric): 1005; Contact Plating: Tin; Min Operating Temperature: -55°C; Max Operating Temperature: 155°C; Tolerance: 1%; Packaging: Tape and Reel; Package Quantity: 10; Resistor Type: Thick Film; Number of Terminations: 2; Termination: Solder; Temperature Coefficient: 100ppm/°C; Max Power Dissipation: 63mW; Features: Automotive AEC-Q200; Series: CRCW; Voltage Rating (DC): 50V; Technology: THICK FILM; Resistance Tolerance: 1%; Construction: Rectangular; Length: 1mm; Width: 0.5mm; Height: 0.35mm; Depth: 0.5mm; Radiation Hardening: No; RoHS Compliant: Yes; Lead Free: Lead Free; REACH SVHC: Unknown; Military Standard: Not; ComponentLink1URL: https://datasheet.ciiva.com/8336/dcrcwe3-8336652.pdf?src-supplier=Avnet; ComponentLink1Description: https://datasheet.ciiva.com/8336/dcrcwe3-8336652.pdf?src-supplier=Avnet; ComponentLink2URL: https://datasheet.ciiva.com/2464/dcrcwe3-2464123.pdf?src-supplier=Digi-Key; ComponentLink2Description: https://datasheet.ciiva.com/2464/dcrcwe3-2464123.pdf?src-supplier=Digi-Key; ComponentLink3URL: https://datasheet.ciiva.com/2464/dcrcwe3-2464124.pdf?src-supplier=Digi-Key; ComponentLink3Description: https://datasheet.ciiva.com/2464/dcrcwe3-2464124.pdf?src-supplier=Digi-Key; ComponentLink4URL: https://datasheet.ciiva.com/2464/dcrcwe3-2464125.pdf?src-supplier=Digi-Key; ComponentLink4Description: https://datasheet.ciiva.com/2464/dcrcwe3-2464125.pdf?src-supplier=Digi-Key; ComponentLink5URL: https://datasheet.ciiva.com/7673/1697337-7673982.pdf?src-supplier=Element14; ComponentLink5Description: https://datasheet.ciiva.com/7673/1697337-7673982.pdf?src-supplier=Element14; ComponentLink6URL: https://datasheet.ciiva.com/7673/1697337-7673983.pdf?src-supplier=Element14; ComponentLink6Description: https://datasheet.ciiva.com/7673/1697337-7673983.pdf?src-supplier=Element14; ComponentLink7URL: https://datasheet.ciiva.com/22869/70201119-22869510.pdf?src-supplier=Allied+Electronics; ComponentLink7Description: https://datasheet.ciiva.com/22869/70201119-22869510.pdf?src-supplier=Allied+Electronics; ComponentLink8URL: https://datasheet.ciiva.com/16776/70201119-16776327.pdf?src-supplier=Allied+Electronics; ComponentLink8Description: https://datasheet.ciiva.com/16776/70201119-16776327.pdf?src-supplier=Allied+Electronics; ComponentLink9URL: https://datasheet.ciiva.com/22708/1697337-22708042.pdf?src-supplier=Element14; ComponentLink9Description: https://datasheet.ciiva.com/22708/1697337-22708042.pdf?src-supplier=Element14; ComponentLink10URL: https://datasheet.ciiva.com/7743/125364-7743511.pdf?src-supplier=Element14; ComponentLink10Description: https://datasheet.ciiva.com/7743/125364-7743511.pdf?src-supplier=Element14; Supplier Part Number 1: 541-205KLCT-ND
R3 = 1M_1/10W_RES_0603: RES SMD 1M OHM 1% 1/10W 0603; MPN: RC0603FR-071ML; Tolerance: 1%; Power: 1/10W; Size: 0603; Supplier 1: Digi-Key; Supplier Part Number 1: 311-1.00MHRCT-ND
R4 = 22k_5%_0402_CRCW040222K0JNED_RES: Res Thick Film 0402 22K Ohm 5% 1/16W ±200ppm/°C Molded SMD SMD Paper T/R; Manufacturer: Vishay Dale; Resistance: 22kR; Power Rating: 63mW; Voltage Rating: 50V; Supplier 1: Digi-Key; Manufacturer Part Number: CRCW040222K0JNED; RoHS: Yes; Category: Chip SMD Resistors; Pricing 1: 1=0.10000, 10=0.03300, 100=0.01360, 1000=0.00610, 2500=0.00529, 5000=0.00437 (USD); Mount: Surface Mount; Case/Package: 0402; Number of Pins: 2; Case Code (Metric): 1005; Case Code (Imperial): 0402; Weight: 2.3E-05oz; Contact Plating: Tin; Min Operating Temperature: -55°C; Max Operating Temperature: 155°C; Tolerance: 5%; Packaging: Tape and Reel; Package Quantity: 1; Resistor Type: Thick Film; Number of Terminations: 2; Temperature Coefficient: 200ppm/°C; Termination: Solder; Max Power Dissipation: 63mW; Features: Automotive AEC-Q200; Voltage Rating (DC): 50V; Series: CRCW; Working Voltage: 50V; Construction: Rectangular; Technology: THICK FILM; Resistance Tolerance: 5%; Length: 1mm; Width: 0.02inch; Height: 0.35mm; Depth: 0.5mm; Radiation Hardening: No; Lead Free: Lead Free; RoHS Compliant: Yes; Military Standard: Not; ComponentLink1URL: https://datasheet.ciiva.com/2462/dcrcwe3-2462082.pdf?src-supplier=Digi-Key; ComponentLink1Description: https://datasheet.ciiva.com/2462/dcrcwe3-2462082.pdf?src-supplier=Digi-Key; ComponentLink2URL: https://datasheet.ciiva.com/2462/dcrcwe3-2462083.pdf?src-supplier=Digi-Key; ComponentLink2Description: https://datasheet.ciiva.com/2462/dcrcwe3-2462083.pdf?src-supplier=Digi-Key; ComponentLink3URL: https://datasheet.ciiva.com/2462/dcrcwe3-2462084.pdf?src-supplier=Digi-Key; ComponentLink3Description: https://datasheet.ciiva.com/2462/dcrcwe3-2462084.pdf?src-supplier=Digi-Key; ComponentLink4URL: https://datasheet.ciiva.com/3256/dcrcwe3-3256245.pdf?src-supplier=Avnet; ComponentLink4Description: https://datasheet.ciiva.com/3256/dcrcwe3-3256245.pdf?src-supplier=Avnet; ComponentLink5URL: https://datasheet.ciiva.com/22872/70201119-22872138.pdf?src-supplier=Allied+Electronics; ComponentLink5Description: https://datasheet.ciiva.com/22872/70201119-22872138.pdf?src-supplier=Allied+Electronics; ComponentLink6URL: https://datasheet.ciiva.com/16776/70201119-16776940.pdf?src-supplier=Allied+Electronics; ComponentLink6Description: https://datasheet.ciiva.com/16776/70201119-16776940.pdf?src-supplier=Allied+Electronics; Supplier Part Number 1: 541-22KJCT-ND
R5 = 100k_1/10W_0603_RES_1: Res Thick Film 0603 100K Ohm 1% 0.1W(1/10W) ±100ppm/C Pad SMD Automotive T/R; Manufacturer: Panasonic; Manufacturer Part Number: ERJ3EKF1003V; Resistance: 100kR; Power Rating: 100mW; Voltage Rating: 75V; Temperature Coefficient: 100ppm/°C; MPN: ERJ-3EKF1003V; Package: 0603; Wattage: 1/10W; Tolerance: 1%; Supplier 1: Digi-Key; RoHS: Yes; Category: Chip SMD Resistors; Pricing 1: 1=0.10000, 10=0.03500, 100=0.01430, 1000=0.00641, 2500=0.00557 (USD); Mount: Surface Mount; Case/Package: 0603; Number of Pins: 2; Case Code (Imperial): 0603; Case Code (Metric): 1608; Contact Plating: Tin; Size Code: 0603; Weight: 7.1E-05oz; Min Operating Temperature: -55°C; Max Operating Temperature: 155°C; Packaging: Tape and Reel; Package Quantity: 5000; Resistor Type: Thick Film; Termination: SMD/SMT; Number of Terminations: 2; Max Power Dissipation: 100mW; Voltage Rating (DC): 75V; Features: Automotive AEC-Q200; Series: ERJ; Resistance Tolerance: 1%; Construction: Rectangular; Length: 1.6mm; Width: 0.8mm; Height: 0.022inch; Depth: 0.8mm; Radiation Hardening: No; REACH SVHC: No SVHC; Military Standard: Not; Lead Free: Lead Free; RoHS Compliant: Yes; ComponentLink1URL: https://datasheet.ciiva.com/34303/1987476-34303566.pdf?src-supplier=Jameco; ComponentLink1Description: https://datasheet.ciiva.com/34303/1987476-34303566.pdf?src-supplier=Jameco; ComponentLink2URL: https://datasheet.ciiva.com/30133/aoa0000ce2-30133845.pdf?src-supplier=Onlinecomponents.com; ComponentLink2Description: https://datasheet.ciiva.com/30133/aoa0000ce2-30133845.pdf?src-supplier=Onlinecomponents.com; ComponentLink3URL: https://datasheet.ciiva.com/16740/aoa0000ce2-16740662.pdf?src-supplier=Future+Electronics; ComponentLink3Description: https://datasheet.ciiva.com/16740/aoa0000ce2-16740662.pdf?src-supplier=Future+Electronics; ComponentLink4URL: https://datasheet.ciiva.com/15158/getdatasheetpartid-247527-15158907.pdf?src-supplier=Verical; ComponentLink4Description: https://datasheet.ciiva.com/15158/getdatasheetpartid-247527-15158907.pdf?src-supplier=Verical; ComponentLink5URL: https://datasheet.ciiva.com/16770/70260748-16770253.pdf?src-supplier=Allied+Electronics; ComponentLink5Description: https://datasheet.ciiva.com/16770/70260748-16770253.pdf?src-supplier=Allied+Electronics; Supplier Part Number 1: P100KHCT-ND
R6 = 10k_1/16W_0402_RES: RES SMD 10K OHM 1% 1/16W 0402; Tolerance: 1%; Power: 1/16W; Size: 0402; MPN: RC0402FR-0710KL
R7 = 680R_1/10W_0603_RES: RES SMD 680 OHM 1% 1/10W 0603; MPN: RC0603FR-07680RL; Tolerance: 1%; Power: 1/10W; Composition: Thick Film; Package: 0603; Supplier 1: Digi-Key; Supplier Part Number 1: 311-680HRCT-ND
R8 R12 R17 = 0R_1/10W_0603_RES: RES SMD 0 OHM JUMPER 1/10W 0603; MPN: RC0603JR-070RL; Tolerance: Jumper; Power: 1/10W; Package/Case: 0603; Supplier 1: Digi-Key; Supplier Part Number 1: 311-0.0GRDKR-ND
R9 = 340k_1%_0402_CRCW0402340KFKED_RES: Res Thick Film 0402 340K Ohm 1% 1/16W ±100ppm/°C Molded SMD SMD Paper T/R; Manufacturer: Vishay; Resistance: 340kR; Max Power Dissipation: 63mW; Voltage Rating: 50V; Supplier 1: Digi-Key; Manufacturer Part Number: CRCW0402340KFKED; RoHS: Yes; Category: Chip SMD Resistors; Pricing 1: 1=0.10000, 10=0.03800, 100=0.01530, 1000=0.00686, 2500=0.00595, 5000=0.00492 (USD); Case/Package: 0402; Number of Pins: 2; Contact Plating: Tin; Weight: 2.3E-05oz; Case Code (Imperial): 0402; Case Code (Metric): 1005; Min Operating Temperature: -55°C; Max Operating Temperature: 155°C; Tolerance: 1%; Resistor Type: Thick Film; Temperature Coefficient: 100ppm/°C; Packaging: Tape and Reel; Package Quantity: 10; Number of Terminations: 2; Features: Automotive AEC-Q200; Series: CRCW; Power Rating: 63mW; Termination: SMD/SMT; Voltage Rating (DC): 50V; Construction: Rectangular; Resistance Tolerance: 1%; Technology: THICK FILM; Length: 1mm; Width: 0.5mm; Height: 0.35mm; Depth: 0.5mm; Radiation Hardening: No; RoHS Compliant: Yes; Lead Free: Lead Free; REACH SVHC: Unknown; Military Standard: Not; ComponentLink1URL: https://datasheet.ciiva.com/11818/0900766b80d98824-11818077.pdf?src-supplier=RSComponents; ComponentLink1Description: https://datasheet.ciiva.com/11818/0900766b80d98824-11818077.pdf?src-supplier=RSComponents; ComponentLink2URL: https://datasheet.ciiva.com/2463/dcrcwe3-2463175.pdf?src-supplier=Digi-Key; ComponentLink2Description: https://datasheet.ciiva.com/2463/dcrcwe3-2463175.pdf?src-supplier=Digi-Key; ComponentLink3URL: https://datasheet.ciiva.com/2463/dcrcwe3-2463176.pdf?src-supplier=Digi-Key; ComponentLink3Description: https://datasheet.ciiva.com/2463/dcrcwe3-2463176.pdf?src-supplier=Digi-Key; ComponentLink4URL: https://datasheet.ciiva.com/2463/dcrcwe3-2463177.pdf?src-supplier=Digi-Key; ComponentLink4Description: https://datasheet.ciiva.com/2463/dcrcwe3-2463177.pdf?src-supplier=Digi-Key; ComponentLink5URL: https://datasheet.ciiva.com/3256/dcrcwe3-3256423.pdf?src-supplier=Avnet; ComponentLink5Description: https://datasheet.ciiva.com/3256/dcrcwe3-3256423.pdf?src-supplier=Avnet; ComponentLink6URL: https://datasheet.ciiva.com/5545/dcrcwe3-109170-5545430.pdf?src-supplier=Mouser; ComponentLink6Description: https://datasheet.ciiva.com/5545/dcrcwe3-109170-5545430.pdf?src-supplier=Mouser; ComponentLink7URL: https://datasheet.ciiva.com/16886/dcrcwe3-16886407.pdf?src-supplier=Avnet+Europe; ComponentLink7Description: https://datasheet.ciiva.com/16886/dcrcwe3-16886407.pdf?src-supplier=Avnet+Europe; ComponentLink8URL: https://datasheet.ciiva.com/22706/1697337-22706215.pdf?src-supplier=Element14; ComponentLink8Description: https://datasheet.ciiva.com/22706/1697337-22706215.pdf?src-supplier=Element14; ComponentLink9URL: https://datasheet.ciiva.com/7674/1697337-7674021.pdf?src-supplier=Element14; ComponentLink9Description: https://datasheet.ciiva.com/7674/1697337-7674021.pdf?src-supplier=Element14; Supplier Part Number 1: 541-340KLDKR-ND
R10 = 20K_0402_1%_ERJ-2RKF2002X_RES: RES SMD 20K OHM 1% 1/10W 0402; Manufacturer: Panasonic; Resistance: 20kR; Power Rating: 100mW; Voltage Rating: 50V; Temperature Coefficient: 100ppm/°C; Supplier 1: Digi-Key; Manufacturer Part Number: ERJ-2RKF2002X; RoHS: Yes; Category: Chip SMD Resistors; Stock 1: 220592; Pricing 1: 1=0.10000, 10=0.02500, 100=0.01020, 1000=0.00457, 2500=0.00397, 5000=0.00328 (USD); Mount: Surface Mount; Case/Package: 0402; Case Code (Metric): 1005; Case Code (Imperial): 0402; Weight: 2.8E-05oz; Contact Plating: Tin; Size Code: 0402; Min Operating Temperature: -55°C; Max Operating Temperature: 155°C; Tolerance: 1%; Packaging: Cut Tape; Package Quantity: 1; Resistor Type: Thick Film; Number of Terminations: 2; Termination: SMD/SMT; Max Power Dissipation: 100mW; Voltage Rating (DC): 50V; Features: Automotive AEC-Q200; Series: ERJ; Technology: THICK FILM; Resistance Tolerance: 1%; Construction: Rectangular; Length: 1mm; Width: 0.02inch; Height: 0.35mm; Depth: 0.5mm; Radiation Hardening: No; REACH SVHC: No SVHC; Military Standard: Not; Lead Free: Lead Free; RoHS Compliant: Yes; ComponentLink1URL: https://datasheet.ciiva.com/11821/0900766b80f80784-11821220.pdf?src-supplier=RSComponents; ComponentLink1Description: https://datasheet.ciiva.com/11821/0900766b80f80784-11821220.pdf?src-supplier=RSComponents; ComponentLink2URL: https://datasheet.ciiva.com/6138/426256-6138761.pdf?src-supplier=Farnell; ComponentLink2Description: https://datasheet.ciiva.com/6138/426256-6138761.pdf?src-supplier=Farnell; ComponentLink3URL: https://datasheet.ciiva.com/48531/aoa0000ce2-48531063.pdf?src-supplier=Avnet; ComponentLink3Description: https://datasheet.ciiva.com/48531/aoa0000ce2-48531063.pdf?src-supplier=Avnet; ComponentLink4URL: https://datasheet.ciiva.com/24159/aoa0000ce2-24159274.pdf?src-supplier=Mouser; ComponentLink4Description: https://datasheet.ciiva.com/24159/aoa0000ce2-24159274.pdf?src-supplier=Mouser; ComponentLink5URL: https://datasheet.ciiva.com/16514/aoa0000ce2-16514269.pdf?src-supplier=Avnet+Asia; ComponentLink5Description: https://datasheet.ciiva.com/16514/aoa0000ce2-16514269.pdf?src-supplier=Avnet+Asia; ComponentLink6URL: https://datasheet.ciiva.com/16508/aoa0000ce2-16508524.pdf?src-supplier=Future+Electronics; ComponentLink6Description: https://datasheet.ciiva.com/16508/aoa0000ce2-16508524.pdf?src-supplier=Future+Electronics; ComponentLink7URL: https://datasheet.ciiva.com/30049/aoa0000ce2-30049982.pdf?src-supplier=Onlinecomponents.com; ComponentLink7Description: https://datasheet.ciiva.com/30049/aoa0000ce2-30049982.pdf?src-supplier=Onlinecomponents.com; ComponentLink8URL: https://datasheet.ciiva.com/28688/1678782-28688600.pdf?src-supplier=Element14; ComponentLink8Description: https://datasheet.ciiva.com/28688/1678782-28688600.pdf?src-supplier=Element14; ComponentLink9URL: https://datasheet.ciiva.com/16782/70260748-16782455.pdf?src-supplier=Allied+Electronics; ComponentLink9Description: https://datasheet.ciiva.com/16782/70260748-16782455.pdf?src-supplier=Allied+Electronics; ComponentLink10URL: https://datasheet.ciiva.com/16762/70260748-16762885.pdf?src-supplier=Allied+Electronics; ComponentLink10Description: https://datasheet.ciiva.com/16762/70260748-16762885.pdf?src-supplier=Allied+Electronics; ComponentLink11URL: https://datasheet.ciiva.com/46377/426256-46377368.pdf?src-supplier=Element14; ComponentLink11Description: https://datasheet.ciiva.com/46377/426256-46377368.pdf?src-supplier=Element14; Supplier Part Number 1: P20.0KLCT-ND
R11 R13 = 0R_1/5W_0402_RCS04020000Z0ED_RES: VISHAY - RCS04020000Z0ED - SMD Chip Resistor, 0402 [1005 Metric], 0 ohm, RCS Series, 50 V, Thick Film, 200 mW; Manufacturer: Vishay Dale; Resistance: 0mR; Max Power Dissipation: 200mW; Supplier 1: Digi-Key; Manufacturer Part Number: RCS04020000Z0ED; RoHS: Yes; Category: Chip SMD Resistors; Stock 1: 18214; Pricing 1: 1=0.10000, 10=0.08300, 25=0.05760, 50=0.04480, 100=0.03200, 250=0.02496, 500=0.01984, 1000=0.01408, 5000=0.01088 (USD); Case/Package: 0402; Case Code (Metric): 1005; Case Code (Imperial): 0402; Min Operating Temperature: -55°C; Max Operating Temperature: 155°C; Packaging: Tape and Reel; Resistor Type: Thick Film; Number of Terminations: 2; Features: Automotive AEC-Q200; Length: 0.039inch; Width: 0.02inch; Height: 0.016inch; RoHS Compliant: Yes; ComponentLink1URL: http://www.farnell.com/datasheets/2618474.pdf?src-supplier=Farnell; ComponentLink1Description: http://www.farnell.com/datasheets/2618474.pdf?src-supplier=Farnell; ComponentLink2URL: http://www.vishay.com/docs/20065/rcse3.pdf?src-supplier=Digi-Key; ComponentLink2Description: http://www.vishay.com/docs/20065/rcse3.pdf?src-supplier=Digi-Key; ComponentLink3URL: http://www.farnell.com/datasheets/2618474.pdf?src-supplier=Element14; ComponentLink3Description: http://www.farnell.com/datasheets/2618474.pdf?src-supplier=Element14; ComponentLink4URL: http://www.farnell.com/datasheets/2618474.pdf?src-supplier=Newark; ComponentLink4Description: http://www.farnell.com/datasheets/2618474.pdf?src-supplier=Newark; Supplier Part Number 1: 541-2877-1-ND
R15 = 75k_0.5%_0603_RT0603DRE0775KL_RES: Res Thin Film 0603 75K Ohm 0.5% 1/10W ±50ppm/°C Molded SMD SMD Paper T/R; Manufacturer: Yageo; Resistance: 75kR; Max Power Dissipation: 100mW; Voltage Rating (DC): 50V; Supplier 1: Digi-Key; Manufacturer Part Number: RT0603DRE0775KL; RoHS: Yes; Category: Chip SMD Resistors; Stock 1: 189; Pricing 1: 1=0.10000, 10=0.09200, 100=0.03520, 1000=0.01549, 2500=0.01338 (USD); Case/Package: 0603; Contact Plating: Tin,Matte; Case Code (Metric): 1608; Case Code (Imperial): 0603; Min Operating Temperature: -55°C; Max Operating Temperature: 155°C; Tolerance: 0.5%; Resistor Type: Thin Film; Temperature Coefficient: 50ppm/°C; Package Quantity: 5000; Packaging: Tape and Reel; Number of Terminations: 2; Features: Moisture Resistant; Series: RT; Length: 0.063inch; Width: 0.031inch; Height: 0.022inch; Radiation Hardening: No; Lead Free: Lead Free; RoHS Compliant: Yes; ComponentLink1URL: https://datasheet.ciiva.com/2566/pyu-rt-1-to-0-05-rohs-l-5-2566386.pdf?src-supplier=Digi-Key; ComponentLink1Description: https://datasheet.ciiva.com/2566/pyu-rt-1-to-0-05-rohs-l-5-2566386.pdf?src-supplier=Digi-Key; ComponentLink2URL: https://datasheet.ciiva.com/8888/pyu-rt-1-to-0-05-rohs-l-4-8888367.pdf?src-supplier=Avnet; ComponentLink2Description: https://datasheet.ciiva.com/8888/pyu-rt-1-to-0-05-rohs-l-4-8888367.pdf?src-supplier=Avnet; Supplier Part Number 1: 311-2666-1-ND
R16 = 2k_1/16_0402_RES: RES SMD 2K OHM 1% 1/16W 0402; MPN: RC0402FR-072KL; Power: 1/16W; PAckage/Case: 0402; Tolerance: 1%
R97 = 56R_1/16W_0402_RES_CRCW040256R0JNED: RES SMD 56 OHM 5% 1/16W 0402; Manufacturer: Vishay Dale; Resistance: 56R; Power Rating: 63mW; Voltage Rating: 50V; Temperature Coefficient: 200ppm/°C; Supplier 1: Digi-Key; Manufacturer Part Number: CRCW040256R0JNED; RoHS: Yes; Category: Chip SMD Resistors; Stock 1: 3243; Pricing 1: 1=0,10000, 10=0,03300, 100=0,01360, 1000=0,00610, 2500=0,00529, 5000=0,00437 (USD); Case/Package: 0402; Case Code (Metric): 1005; Case Code (Imperial): 0402; Weight: 2.3E-05oz; Contact Plating: Tin; Size Code: 0402; Min Operating Temperature: -55°C; Max Operating Temperature: 155°C; Tolerance: 5%; Packaging: Tape and Reel; Resistor Type: Thick Film; Package Quantity: 1; Number of Terminations: 2; Max Power Dissipation: 63mW; Voltage Rating (DC): 50V; Features: Automotive AEC-Q200; Series: CRCW; Termination: SMD/SMT; Construction: Rectangular; Technology: THICK FILM; Resistance Tolerance: 5%; Length: 1mm; Width: 0.02inch; Height: 0.35mm; Depth: 0.5mm; Radiation Hardening: No; Lead Free: Lead Free; RoHS Compliant: Yes; Military Standard: Not; REACH SVHC: Unknown; ComponentLink1URL: https://datasheet.ciiva.com/5542/dcrcwe3-109170-5542906.pdf?src-supplier=Mouser; ComponentLink1Description: https://datasheet.ciiva.com/5542/dcrcwe3-109170-5542906.pdf?src-supplier=Mouser; ComponentLink2URL: https://datasheet.ciiva.com/3256/dcrcwe3-3256661.pdf?src-supplier=Avnet; ComponentLink2Description: https://datasheet.ciiva.com/3256/dcrcwe3-3256661.pdf?src-supplier=Avnet; ComponentLink3URL: https://datasheet.ciiva.com/2462/dcrcwe3-2462223.pdf?src-supplier=Digi-Key; ComponentLink3Description: https://datasheet.ciiva.com/2462/dcrcwe3-2462223.pdf?src-supplier=Digi-Key; ComponentLink4URL: https://datasheet.ciiva.com/2462/dcrcwe3-2462224.pdf?src-supplier=Digi-Key; ComponentLink4Description: https://datasheet.ciiva.com/2462/dcrcwe3-2462224.pdf?src-supplier=Digi-Key; ComponentLink5URL: https://datasheet.ciiva.com/2462/dcrcwe3-2462225.pdf?src-supplier=Digi-Key; ComponentLink5Description: https://datasheet.ciiva.com/2462/dcrcwe3-2462225.pdf?src-supplier=Digi-Key; ComponentLink6URL: https://datasheet.ciiva.com/8341/dcrcwe3-8341309.pdf?src-supplier=Avnet; ComponentLink6Description: https://datasheet.ciiva.com/8341/dcrcwe3-8341309.pdf?src-supplier=Avnet; ComponentLink7URL: https://datasheet.ciiva.com/16787/70201119-16787145.pdf?src-supplier=Allied+Electronics; ComponentLink7Description: https://datasheet.ciiva.com/16787/70201119-16787145.pdf?src-supplier=Allied+Electronics; Supplier Part Number 1: 541-56JCT-ND
U1 = LT8619_BUCK_5V_1.2A: LT8619 - 60V, 1.2A Synchronous Monolithic Buck Regulator with 6µA Quiescent Current; Manufacturer: Analog Devices / Linear Technology; Supplier 1: Digi-Key; Manufacturer Part Number: LT8619IMSE-5#PBF; RoHS: Yes; Stock 1: 288; Pricing 1: 1=7.27000, 10=6.56400, 25=6.25840, 100=5.43400, 250=5.18976, 500=4.75200 (USD); Number of Pins: 16; RoHS Compliant: Yes; Supplier Part Number 1: LT8619IMSE-5#PBF-ND
U2 = TPS62410DRCR_DUAL_BUCK: TPS62410 2.25MHZ 2X800MA Dual St; Manufacturer: Texas Instruments; Output Voltage: 6V; Output Current: 800mA; Number of Outputs: 2; Efficiency: 95%; Min Input Voltage: 2.5V; Min Output Voltage: 600mV; Synchronous Rectifier: Yes; Quiescent Current: 32uA; Topology: Boost; Output Type: Adjustable; Output Configuration: Positive; Supplier 1: Digi-Key; Supplier Part Number 1: 296-25488-6-ND; Manufacturer Part Number: TPS62410DRCR; RoHS: Yes; Category: Voltage Regulators - Switching; Pricing 1: 1=2.06000, 10=1.84800, 25=1.74360, 100=1.48560, 250=1.39496, 500=1.22060, 1000=1.15150 (USD); Case/Package: VSON; Number of Pins: 10; Weight: 0.000921oz; Contact Plating: Gold; Min Operating Temperature: -40°C; Max Operating Temperature: 85°C; Packaging: Tape and Reel; Package Quantity: 1; Switching Frequency: 2.25MHz; Max Output Current: 800mA; Max Input Voltage: 6V; Max Output Voltage: 6V; Operating Supply Voltage: 6V; Series: -; Current - Output 1: 800mA; Current - Output 2: 800mA; Voltage - Output 1: 6V; Voltage - Output 2: 6V; Nominal Supply Current: 32uA; Radiation Hardening: No; REACH SVHC: No SVHC; Lead Free: Lead Free; RoHS Compliant: Yes; ComponentLink1URL: https://datasheet.ciiva.com/4880/slvs737-198198-4880994.pdf?src-supplier=Mouser; ComponentLink1Description: https://datasheet.ciiva.com/4880/slvs737-198198-4880994.pdf?src-supplier=Mouser; ComponentLink2URL: https://datasheet.ciiva.com/2026/tps62410-2026459.pdf?src-supplier=Digi-Key; ComponentLink2Description: https://datasheet.ciiva.com/2026/tps62410-2026459.pdf?src-supplier=Digi-Key; ComponentLink3URL: https://datasheet.ciiva.com/2026/tps62410-2026460.pdf?src-supplier=Digi-Key; ComponentLink3Description: https://datasheet.ciiva.com/2026/tps62410-2026460.pdf?src-supplier=Digi-Key; ComponentLink4URL: https://datasheet.ciiva.com/2026/tps62410-2026461.pdf?src-supplier=Digi-Key; ComponentLink4Description: https://datasheet.ciiva.com/2026/tps62410-2026461.pdf?src-supplier=Digi-Key; ComponentLink5URL: https://datasheet.ciiva.com/14303/tps62421-14303710.pdf?src-supplier=Avnet; ComponentLink5Description: https://datasheet.ciiva.com/14303/tps62421-14303710.pdf?src-supplier=Avnet
U8 = TMS320F28388D_32bit_uC: 32-bit MCU with connectivity manager, 2x C28x+CLA CPU, 1.5 MB flash, FPU64, CLB, Ethernet, EtherCAT 337-NFBGA -40 to +125; Manufacturer: Texas instruments; Standoff Height: 0.35mm; Number Of Usb Channels: 1; Max Junction Temp: +125°C; Data Bus Width: 32bits; Number Of I/Os: 169; Number Of A/D Converters: 4; Number Of Cores: 2; Number Of Uart Channels: 5; Min Supply Voltage: 1.14V; Memory Size: 1.5MBytes; Interface: I2C,SPI,UART,EBI/EMI,CAN,USB,SCI,IrDA,Ethernet,I2S,SMBus,LVCMOS,Other; Number Of Timers/Counters: 6; Number Of Adc Channels: 24; Ram Size: 312KBytes; Max Supply Voltage: 3.47V; Frequency: 200MHz; Core Architecture: C28x; Number Of Pwm Channels: 32; Number Of I2C Channels: 3; Device Class L1: Integrated Circuits (ICs); Category: IC; ComponentLink2URL: http://www.ti.com/lit/ds/symlink/tms320f28388s.pdf; Number Of Ethernet Channels: 1; Memory Type: FLASH; Device Class L2: Embedded Processors and Controllers; ComponentLink2Description: Datasheet; Package: ZWT0337A; Temperature Range Low: -40°C; RoHS: TRUE; Lead Free: Yes; Device Class L3: Microcontrollers; Automotive: No; Height: 1.4mm; Ambient Temperature Range Low: -40°C; Ipc Land Pattern Name: BGA361N80P19X19_1600X1600X140; Number Of Spi Channels: 4; Ambient Temperature Range High: +125°C; Octopart: https://octopart.com/f28388dzwts-texas+instruments-102550657; Manufacturer Part Number: F28388DZWTS; Temperature Range High: +125°C; Temperature: -40°C to +125°C